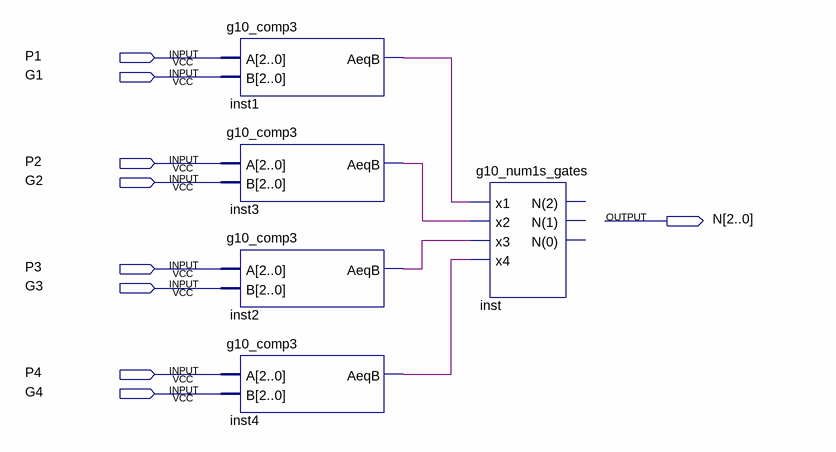
[diagram p0: schematic sheet]
// Quartus schematic g10_num_matches.bdf as structural Verilog: 5 symbols, 9 pins
module g10_num_matches (
  input  P1,
  input  G1,
  input  P2,
  input  G2,
  input  P3,
  input  G3,
  input  P4,
  input  G4,
  output [2:0] N
);

  wire inst1_aeqb, inst2_aeqb, inst3_aeqb, inst4_aeqb;

  g10_comp3 inst1 (.A({3{P1}}), .B({3{G1}}), .AeqB(inst1_aeqb));
  g10_comp3 inst3 (.A({3{P2}}), .B({3{G2}}), .AeqB(inst3_aeqb));
  g10_comp3 inst2 (.A({3{P3}}), .B({3{G3}}), .AeqB(inst2_aeqb));
  g10_comp3 inst4 (.A({3{P4}}), .B({3{G4}}), .AeqB(inst4_aeqb));
  g10_num1s_gates inst (.x1(inst1_aeqb), .x2(inst3_aeqb), .x3(inst2_aeqb), .x4(inst4_aeqb));  // open: N(2), N(1), N(0)
endmodule
